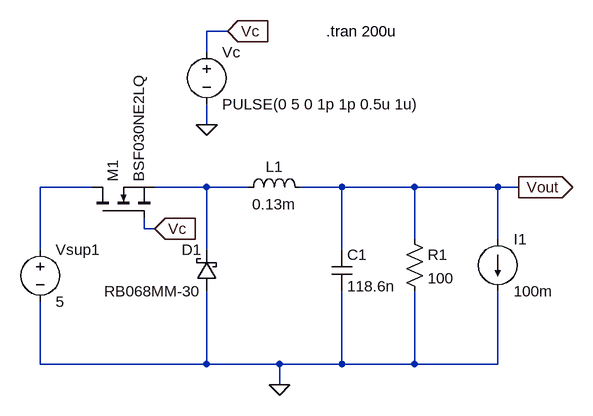
[diagram p0: schematic Q1.asc]
Q1.asc, the LTspice schematic file:
Version 4
SHEET 1 916 680
WIRE 368 0 336 0
WIRE 336 32 336 0
WIRE 336 144 336 112
WIRE 160 240 80 240
WIRE 336 240 256 240
WIRE 400 240 336 240
WIRE 544 240 480 240
WIRE 656 240 544 240
WIRE 784 240 656 240
WIRE 816 240 784 240
WIRE 240 304 240 288
WIRE 256 304 240 304
WIRE 656 320 656 240
WIRE 784 320 784 240
WIRE 80 336 80 240
WIRE 336 336 336 240
WIRE 544 336 544 240
WIRE 80 512 80 416
WIRE 336 512 336 400
WIRE 336 512 80 512
WIRE 448 512 336 512
WIRE 544 512 544 400
WIRE 544 512 448 512
WIRE 656 512 656 400
WIRE 656 512 544 512
WIRE 784 512 784 400
WIRE 784 512 656 512
WIRE 448 544 448 512
FLAG 448 544 0
FLAG 336 144 0
FLAG 368 0 Vc
IOPIN 368 0 In
FLAG 816 240 Vout
IOPIN 816 240 Out
FLAG 256 304 Vc
IOPIN 256 304 In
SYMBOL ind 384 256 R270
WINDOW 0 32 56 VTop 2
WINDOW 3 5 56 VBottom 2
SYMATTR InstName L1
SYMATTR Value 0.13m
SYMBOL cap 528 336 R0
SYMATTR InstName C1
SYMATTR Value 118.6n
SYMBOL res 640 304 R0
SYMATTR InstName R1
SYMATTR Value 100
SYMBOL current 784 320 R0
SYMATTR InstName I1
SYMATTR Value 100m
SYMBOL voltage 80 320 R0
SYMATTR InstName Vsup1
SYMATTR Value 5
SYMBOL voltage 336 16 R0
SYMATTR InstName Vc
SYMATTR Value PULSE(0 5 0 1p 1p 0.5u 1u)
SYMBOL nmos 160 288 R270
SYMATTR InstName M1
SYMATTR Value BSF030NE2LQ
SYMBOL schottky 352 400 R180
WINDOW 0 24 64 Left 2
WINDOW 3 24 0 Left 2
SYMATTR InstName D1
SYMATTR Value RB068MM-30
SYMATTR Description Diode
SYMATTR Type diode
TEXT 520 0 Left 2 !.tran 200u

The netlist it stands for:
* Q1.asc
L1 N002 Vout 0.13m
C1 Vout 0 118.6n
R1 Vout 0 100
I1 Vout 0 100m
Vsup1 N001 0 5
Vc Vc 0 PULSE(0 5 0 1p 1p 0.5u 1u)
M1 N001 Vc N002 N002 BSF030NE2LQ
D1 0 N002 RB068MM-30
.model D D
.lib standard.dio
.model NMOS NMOS
.model PMOS PMOS
.lib standard.mos
.tran 200u
.backanno
.end